# Altium project GPS_tracker.PrjPcb
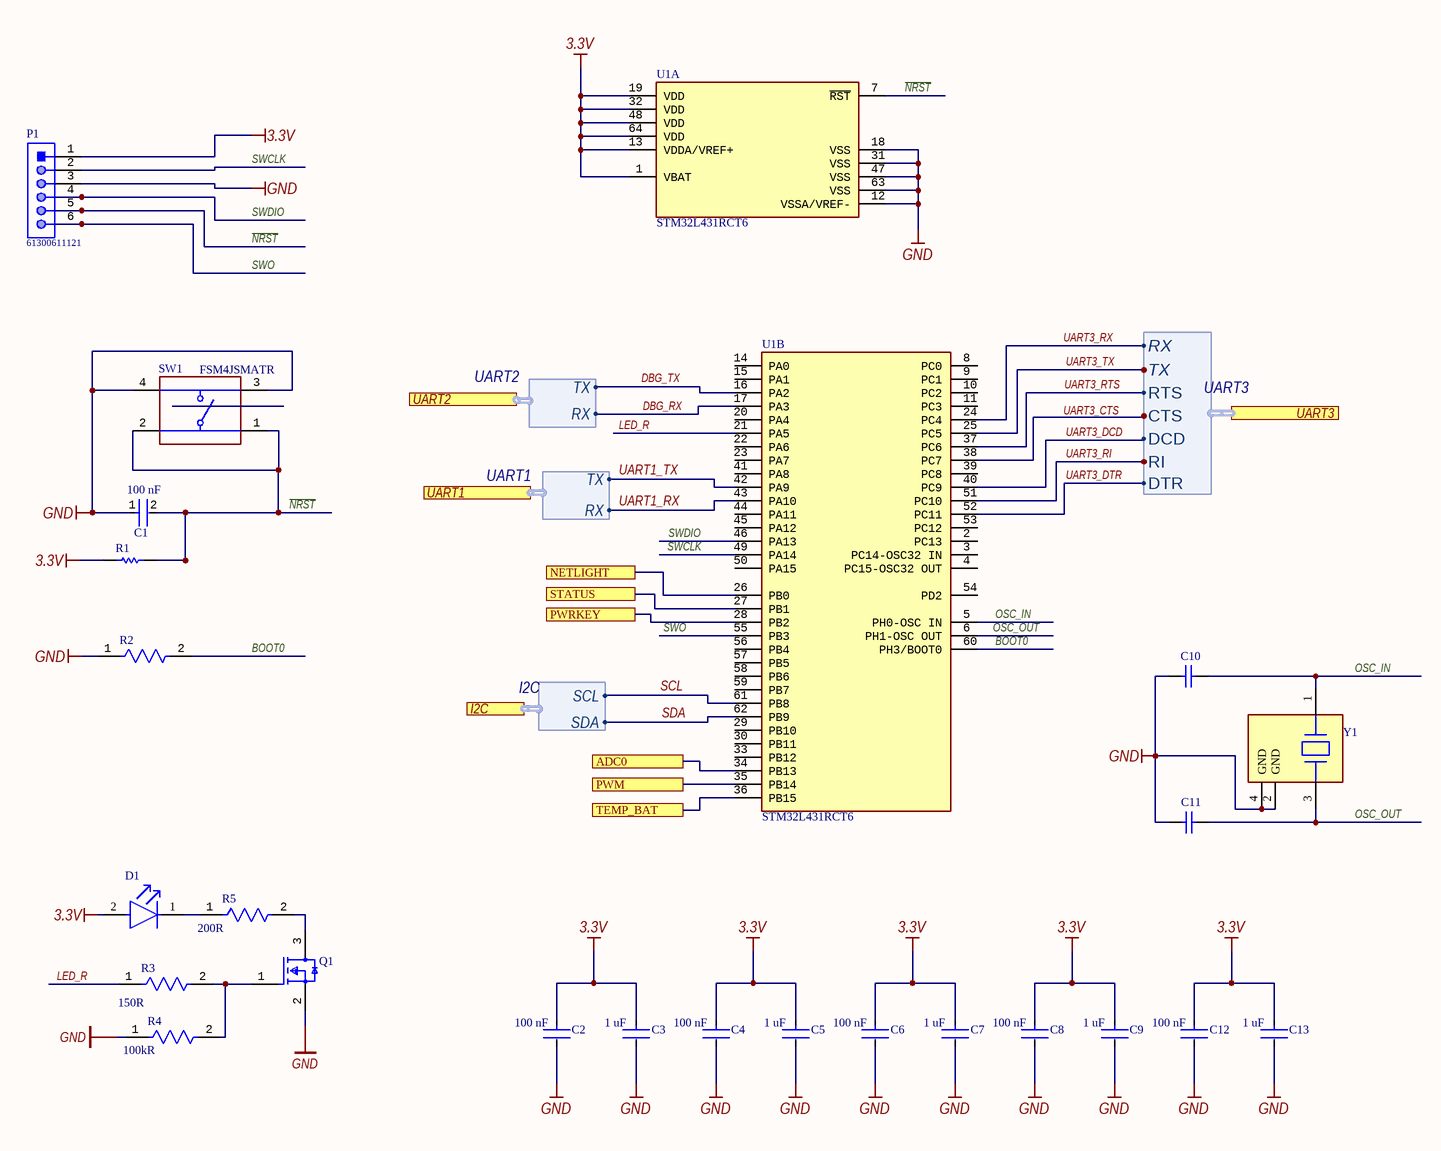
[diagram p0: GPS_tracker MCU.SchDoc]
Title2str: Project; Title: Device; ProjectNumber: 000654321; Organization: Encata
3 sheets, 71 parts. Net scope: flat (ports and power ports of the same name join across sheets).
Board file: GPS_tracker PCB.PcbDoc
Sheets:
  GPS_tracker MCU.SchDoc
  GPS_tracker PWR.SchDoc
  GPS_tracker_GPS_and_GSM.SchDoc

## Sheet GPS_tracker MCU.SchDoc: Device
size 420 x 297 mm; SheetNumber: 1; SheetTotal: 3; ProjectTitle: Prj name

### Parts
C1  Capacitance: 100 nF  [FP-CC0603-DA-MFG]  (hidden comment: CC0603KRX7R7BB104)
C2  Capacitance: 100 nF  [FP-CC0603-DA-MFG]  (hidden comment: CC0603KRX7R7BB104)
C3  Capacitance: 1 uF  [FP-CC0603-DA-MFG]  (hidden comment: CC0603KRX7R7BB105)
C4  Capacitance: 100 nF  [FP-CC0603-DA-MFG]  (hidden comment: CC0603KRX7R7BB104)
C5  Capacitance: 1 uF  [FP-CC0603-DA-MFG]  (hidden comment: CC0603KRX7R7BB105)
C6  Capacitance: 100 nF  [FP-CC0603-DA-MFG]  (hidden comment: CC0603KRX7R7BB104)
C7  Capacitance: 1 uF  [FP-CC0603-DA-MFG]  (hidden comment: CC0603KRX7R7BB105)
C8  Capacitance: 100 nF  [FP-CC0603-DA-MFG]  (hidden comment: CC0603KRX7R7BB104)
C9  Capacitance: 1 uF  [FP-CC0603-DA-MFG]  (hidden comment: CC0603KRX7R7BB105)
C10  CC0603JRNPO9BN180  [CAPC1608X90X40LL10T20]  (value not drawn)
C11  CC0603JRNPO9BN180  [CAPC1608X90X40LL10T20]  (value not drawn)
C12  Capacitance: 100 nF  [FP-CC0603-DA-MFG]  (hidden comment: CC0603KRX7R7BB104)
C13  Capacitance: 1 uF  [FP-CC0603-DA-MFG]  (hidden comment: CC0603KRX7R7BB105)
D1  150060RS75000  [FP-150060RS75000-MFG]  (value not drawn)
P1  61300611121  [61300611121]
Q1  MMBF170LT1G  [FP-318-08-IPC_B]  (value not drawn)
R1  ERJ3EKF1002V  [RESC1609X55X30LL15T15]  (value not drawn)
R2  AC0603FR-071KL  [FP-AC0603-IPC_B]  (value not drawn)
R3  Resistance: 150R  [FP-AC0603-MFG]  (hidden comment: AC0603FR-07150RL)
R4  Resistance: 100kR  [FP-RC0603-0_55-MFG]  (hidden comment: RC0603FR-07100KL)
R5  Resistance: 200R  [FP-ERJ3EK-IPC_C]  (hidden comment: ERJ-3EKF2000V)
SW1  FSM4JSMATR  [TECO-FSM4JSMATR_V]
U1  STM32L431RCT6  [FP-LQFP64-5W-MFG]  (parts A,B of 2)
Y1  ABM3B-8.000MHZ-B2-T  [FP-ABM3B-MFG]  (value not drawn)

### Ports
ADC0, I2C (harness I2C), NETLIGHT, PWM, PWRKEY, STATUS, TEMP_BAT, UART1 (harness UART1), UART2 (harness UART2), UART3 (harness UART3)

### Harnesses
UART1: RX, TX
UART2: RX, TX
I2C: SCL, SDA
UART3: RX, TX, RTS, CTS, DCD, RI, DTR

### Nets
3.3V: C2.1 C3.1 C4.1 C5.1 C6.1 C7.1 C8.1 C9.1 C12.1 C13.1 D1.2(A) P1.1 R1.1 U1.1(VBAT) U1.13(VDDA/VREF+) U1.19(VDD) U1.32(VDD) U1.48(VDD) U1.64(VDD)
GND: C1.1 C2.2 C3.2 C4.2 C5.2 C6.2 C7.2 C8.2 C9.2 C10.1 C11.1 C12.2 C13.2 P1.3 Q1.2(S) R2.1 R4.1 SW1.3 SW1.4 U1.12(VSSA/VREF-) U1.18(VSS) U1.31(VSS) U1.47(VSS) U1.63(VSS) Y1.2(GND) Y1.4(GND)
BOOT0: R2.2 U1.60(PH3/BOOT0)
LED_R: R3.1 U1.21(PA5)
~{NRST}: C1.2 P1.5 R1.2 SW1.1 SW1.2 U1.7(~{RST})
OSC_IN: C10.2 U1.5(PH0-OSC_IN) Y1.1
OSC_OUT: C11.2 U1.6(PH1-OSC_OUT) Y1.3
SCL: U1.61(PB8) ; port I2C.SCL
SDA: U1.62(PB9) ; port I2C.SDA
SWCLK: P1.2 U1.49(PA14)
SWDIO: P1.4 U1.46(PA13)
SWO: P1.6 U1.55(PB3)
UART1_RX: U1.43(PA10) ; port UART1.RX
UART1_TX: U1.42(PA9) ; port UART1.TX
UART3_DCD: U1.40(PC9) ; port UART3.DCD
UART3_DTR: U1.52(PC11) ; port UART3.DTR
UART3_RI: U1.51(PC10) ; port UART3.RI
UART3_RTS: U1.37(PC6) ; port UART3.RTS
UART3_TX: U1.25(PC5) ; port UART3.TX
NetD1_1: D1.1(C) R5.1
NetQ1_1: Q1.1(G) R3.2 R4.2
NetQ1_3: Q1.3(D) R5.2
NetU1_16: U1.16(PA2) ; port UART2.TX
NetU1_17: U1.17(PA3) ; port UART2.RX
NetU1_24: U1.24(PC4) ; port UART3.RX
NetU1_26: U1.26(PB0) ; port NETLIGHT
NetU1_27: U1.27(PB1) ; port STATUS
NetU1_28: U1.28(PB2) ; port PWRKEY
NetU1_34: U1.34(PB13) ; port ADC0
NetU1_35: U1.35(PB14) ; port PWM
NetU1_36: U1.36(PB15) ; port TEMP_BAT
NetU1_38: U1.38(PC7) ; port UART3.CTS

Not connected (* = marked no-connect by the designer): U1 2(PC13) 3(PC14-OSC32_IN) 4(PC15-OSC32_OUT) 8(PC0) 9(PC1) 10(PC2) 11(PC3) 14(PA0) 15(PA1) 20(PA4) 22(PA6) 23(PA7) 29(PB10) 30(PB11) 33(PB12) 39(PC8) 41(PA8) 44(PA11) 45(PA12) 50(PA15) 53(PC12) 54(PD2) 56(PB4) 57(PB5) 58(PB6) 59(PB7)

### Notes on the sheet
- Labels drawn without touching a wire or pin: DBG_RX, DBG_TX, UART3_CTS, UART3_RX
- Title:
- Author:
- Approved:
- Size:
- Date:
- Git Hash:
- A3
- Prj:
- Sheet
- of
- SW Version:
- Variant:
- Edited:
- CONFIDENTIAL
- File:

### Library data of the parts
C1 C2 C4 C6 C8 C12 = CMP-2000-05002-2: CAP CER 0.1UF 16V X7R 0603; Manufacturer: YAGEO; Tolerance: 0.1; Value: 100 nF; Temperature Coefficient: 15%; Material: Ceramic; Voltage Rating: 16 V; Package: CC0603-DA; ComponentLink2Description: Datasheet; Octopart: https://octopart.com/cc0603krx7r7bb104-yageo-192941; Temperature Range High: +125°C; Digikey Description: CAP CER 0.1UF 16V X7R 0603; Voltage: 16 V; Device Class L2: Capacitors; Height: 0.9mm; Temperature: -55°C to +125°C; Manufacturer Part Number: CC0603KRX7R7BB104; Device Class L1: Passive Components; Device Class L3: Ceramic Capacitors; ComponentLink2URL: http://www.yageo.com/documents/recent/UPY-GPHC_X7R_6.3V-to-50V_18.pdf; Footprint Url: http://www.yageo.com/exep/pages/download/literatures/UPY-C_GEN_24.pdf; RoHS: TRUE; Temperature Range Low: -55°C; Temperature Characteristic: X7R; Lead Free: Yes; Category: Cap; Mouser Description: Multilayer Ceramic Capacitor, CC Series, 0.1 - F, - 10%, X7R, 16 V, 0603 [1608 Metric]; Automotive: No
C3 C5 C7 C9 C13 = CMP-03422-000924-1: CAP CER 1UF 16V X7R 0603; Manufacturer: YAGEO; Tolerance: 0.1; Temperature Coefficient: 15%; Material: Ceramic; Package: CC0603-DA; RoHS: TRUE; Device Class L2: Capacitors; Temperature Characteristic: X7R; Temperature: -55°C to +125°C; Temperature Range Low: -55°C; Automotive: No; ComponentLink2Description: Datasheet; Value: 1 uF; Lead Free: Yes; ComponentLink2URL: http://www.yageo.com/documents/recent/UPY-GPHC_X7R_6.3V-to-50V_18.pdf; Device Class L1: Passive Components; Voltage: 16 V; Octopart: https://octopart.com/cc0603krx7r7bb105-yageo-42271928; Category: Cap; Digikey Description: CAP CER 1UF 16V X7R 0603; Footprint Url: http://www.yageo.com/exep/pages/download/literatures/UPY-C_GEN_24.pdf; Height: 0.9mm; Manufacturer Part Number: CC0603KRX7R7BB105; Voltage Rating: 16 V; Temperature Range High: +125°C; Mouser Description: Multilayer Ceramic Capacitor, CC Series, 1 - F, - 10%, X7R, 16 V, 0603 [1608 Metric]; Device Class L3: Ceramic Capacitors
C10 C11 = CMP-1659-00030-1: Chip Capacitor, 18 pF, +/- 5%, 50 V, -55 to 125 degC, 0603 (1608 Metric), RoHS, Tape and Reel; Voltage Rating: 50 V; Case\Package: 0603; Power Rating: 100 mW; Resistance: 68.1 Ohm; Tolerance: 1%; Case Code (Metric): 1608; Max Operating Temperature: 155 degC; RoHSCompliant: true; Case Code (Imperial): 0603; ComponentLink2Description: Datasheet; Package Quantity: 200; PackageReference: 0603; ComponentLink2URL: http://www.yageo.com/NewPortal/yageodocoutput?fileName=/pdf/MLCC/UPY-GP_NP0_16V-to-50V_14.pdf; Length: 1.6 mm; DatasheetVersion: Rev. 14, 07/2016; Min Operating Temperature: -55 degC; ComponentLink1URL: http://www.yageo.com/; Width: 0.8 mm; ComponentLink1Description: Manufacturer URL; Height: 0.45 mm; Radiation Hardening: No; PackageDescription: 2-Pin Surface Mount Device, Body 1.6 x 0.8 mm; Packaging: Tape and Reel
D1 = CMP-1426-00001-2: LED RED CLEAR 0603 SMD; Luminous Intensity: 250mcd; Viewing Angle: 140°; Dominant Wavelength: 625nm; Test Current: 20mA; Forward Current: 30mA; Forward Voltage: 2V; Lens Color: Colorless; Lens Size: 0.7mm; Width: 0.8mm; Series: WL-SMCW; Color: Red; Min Operating Temperature: -40°C; RoHS Compliant: Yes; Height: 0.8mm; Package Quantity: 1; Packaging: Cut Tape; Mount: Surface Mount; Case/Package: 0603; Lens Transparency: Clear; Length: 1.6mm; Case Code (Imperial): 0603; Lens Style: Clear; Wavelength: 625nm; Max Operating Temperature: 85°C; Case Code (Metric): 1608
P1 = CMP-1502-01070-1: THT Vertical Pin Header WR-PHD, Pitch 2.54 mm, Single Row, 6 pins; Manufacturer: Wurth Elektronik; Gender: Male; Pin Number: 6; Pitch: 2.54mm; Working Voltage: 250VAC; Rated Current: 3A; Withstanding Voltage: 500VAC; Contact Resistance: 20mOhm; Operating Temperature: -40to105degC; Packaging: Bag; Datasheet URL: https://katalog.we-online.de/em/datasheet/6130xx11121.pdf; Package Reference: 61300611121; Mounting Technology: THT; Publisher: WurthElektronik; Part Number: 61300611121; Manufacturer URL: http://www.we-online.de; Row Number: Single; Orientation: Vertical
Q1 = CMP-1058-00793-2: MOSFET N-CH 60V 500MA SOT-23; Polarization: N; Rds On Max: 5R; Power Dissipation: 225mW; Number of Elements: 1; Element Configuration: Single; Input Capacitance: 60pF; Threshold Voltage: 3V; Polarity: N-CHANNEL; Gate to Source Voltage (Vgs): 20V; Turn-Off Delay Time: 10ns; Drain to Source Breakdown Voltage: 60V; On-State Resistance: 5R; Width: 1.3mm; Voltage Rating (DC): 60V; Package Quantity: 3000; Max Operating Temperature: 150°C; Drain to Source Resistance: 5R; Drain-source On Resistance-Max: 5R; Packaging: Tape and Reel; REACH SVHC: No SVHC; Case/Package: SOT-23-3; Number of Pins: 3; RoHS Compliant: Yes; Radiation Hardening: No; Min Operating Temperature: -55°C; Continuous Drain Current (ID): 500mA; Lead Free: Lead Free; Height: 0.94mm; Current Rating: 500mA; Turn-On Delay Time: 10ns; Series: -; Max Power Dissipation: 225mW; Length: 2.9mm; Nominal Vgs: 3V
R1 = CMP-1012-00623-3: Chip Resistor, 10 KOhm, +/- 1%, 0.1 W, -55 to 155 degC, 0603 (1608 Metric), RoHS, Tape and Reel; Manufacturer: Panasonic; Voltage Rating: 75V; Case\/Package: 0603; Power Rating: 100mW; Resistance: 10KOhm; Temperature Coefficient: 100ppm\/degreesC; Number of Pins: 2; Package Reference: 603; Depth: 0.8mm; Mount: SurfaceMount; Package Description: 2-Pin Surface Mount Device, Body 1.6 x 0.85 mm; Datasheet Version: 02/2017; Length: 1.6mm; Lead Free: LeadFree; Height: 0.45mm; Number of Terminations: 2; Max Power Dissipation: 100mW; Min Operating Temperature: -55degC; Datasheet URL: https://industrial.panasonic.com/cdbs/www-data/pdf/RDA0000/AOA0000C304.pdf; Termination: SMD/SMT; Case Code (Metric): 1608; Case Code (Imperial): 0603; Tolerance: 1%; Max Operating Temperature: 155degC; RoHSCompliant: true; Voltage Rating (DC): 75V; Radiation Hardening: No; Packaging: TapeandReel; Composition: ThickFilm; Mounting Technology: SurfaceMount; Manufacturer URL: http://www.panasonic.com/; Width: 0.031inch; REACH SVHC: NoSVHC; Contact Plating: Tin; Military Standard: Not; Package Quantity: 1
R2 = CMP-2000-04828-3: RES 1kΩ 1.00% 0.1W 0603; Voltage Rating: 50V; Power Rating: 100mW; Tolerance: 1%; Temperature Coefficient: 100ppm/°C; Resistance: 1kR; Depth: 0.8mm; Case/Package: 0603; Size Code: 0603; Case Code (Metric): 1608; Height: 0.022inch; Series: AC; Width: 0.031inch; Construction: Rectangular; Length: 0.063inch; Case Code (Imperial): 0603; Package Quantity: 1; RoHS Compliant: Yes; Features: Moisture Resistant; Resistor Type: Thick Film; Max Power Dissipation: 100mW; Packaging: Tape and Reel; Termination: SMD/SMT; Ratings: AEC-Q200; Max Operating Temperature: 155°C; Min Operating Temperature: -55°C; Military Standard: Not; Lead Free: Lead Free; Number of Terminations: 2
R3 = CMP-2000-04821-3: RES 150Ω 1.00% 0.1W 0603; Voltage Rating: 50V; Power Rating: 100mW; Temperature Coefficient: 100ppm/°C; Tolerance: 1%; Resistor Type: Thick Film; Features: Moisture Resistant; Ratings: AEC-Q200; Width: 0.8mm; Packaging: Tape and Reel; Case/Package: 0603; Series: AC; RoHS Compliant: Yes; Max Power Dissipation: 100mW; Case Code (Imperial): 0603; Min Operating Temperature: -55°C; Height: 0.45mm; Termination: SMD/SMT; Number of Terminations: 2; Case Code (Metric): 1608; Max Operating Temperature: 155°C; Length: 1.6mm
R4 = CMP-2100-03662-2: RES SMD 100K OHM 1% 1/10W 0603; Voltage Rating (DC): 50V; Max Power Dissipation: 100mW; Temperature Coefficient: 100ppm/°C; Working Voltage: 75V; Length: 1.6mm; Lead Free: Lead Free; Number of Terminations: 2; Packaging: Tape and Reel; Voltage Rating: 50V; Termination: SMD/SMT; Width: 0.8mm; Resistor Type: Thick Film; Resistance Tolerance: 1%; Features: Moisture Resistant; Height: 0.45mm; Construction: Rectangular; Case/Package: 0603; Military Standard: Not; Case Code (Imperial): 0603; Series: RC; Technology: THICK FILM; Depth: 0.8mm; RoHS Compliant: Yes; REACH SVHC: No SVHC; Min Operating Temperature: -55°C; Case Code (Metric): 1608; Max Operating Temperature: 155°C; Power Rating: 100mW; Number of Pins: 2; Tolerance: 1%
R5 = CMP-2000-00316-2: RES SMD 200 OHM 1% 1/10W 0603; Power Rating: 100mW; Temperature Coefficient: 100ppm/°C; Voltage Rating (DC): 50V; Voltage Rating: 75V; Tolerance: 1%; Lead Free: Lead Free; Packaging: Tape and Reel; Case/Package: 0603; Contact Plating: Tin; Case Code (Imperial): 0603; Min Operating Temperature: -55°C; Max Operating Temperature: 155°C; Max Power Dissipation: 100mW; Features: Automotive AEC-Q200; Technology: THICK FILM; Package Quantity: 1; Resistor Type: Thick Film; REACH SVHC: No SVHC; Termination: SMD/SMT; Length: 1.6mm; Resistance Tolerance: 1%; Series: ERJ; Military Standard: Not; Radiation Hardening: No; Working Voltage: 75V; Case Code (Metric): 1608; RoHS Compliant: Yes; Mount: Surface Mount; Construction: Rectangular; Width: 0.031inch; Number of Terminations: 2; Depth: 0.8mm; Height: 0.022inch
SW1 = CMP-2000-07486-1: Micro Miniature Push Button Switch FSM JSM, 50 mA, -35 to 85 degC, 4-Pin SMD, RoHS, Tape and Reel; Manufacturer: TE Connectivity; Mechanical Life: 100000Cycles; Current Rating: 50mA; Actuator Material: Polyamide; Max Voltage Rating (DC): 12V; Capacitance: 0f; Illumination Type: Illuminated; Voltage Rating (DC): 24V; Case\/Package: SMD/SMT; Operating Force: 160gf; Contact Resistance: 100mOhm; Actuator Length: 0.055inch; Switch Travel: 0.25mm; Throw Configuration: SPST; Termination: GullWing; Contact Plating: Silver; Orientation: Straight; Mounting Technology: SurfaceMount; REACH SVHC: Unknown; Electrical Life: 100000Cycles; Package Reference: FSM4JSMATR; Max Operating Temperature: 85degC; Manufacturer URL: http://www.te.com/; Package Description: 4-Pin Surface Mount Device, Body 6 x 6 mm, Pitch 4.5 mm; Datasheet Version: Rev. V, 02/2015; Packaging: TapeandReel; Min Operating Temperature: -35degC; Mount: SurfaceMount; Contact Current Rating: 50mA; Contact Material: CopperAlloy; Package Quantity: 1200; Datasheet URL: http://www.te.com/commerce/DocumentDelivery/DDEController?Action=showdoc&DocId=Customer+Drawing%7F2-1437565-7%7FV%7Fpdf%7FEnglish%7FENG_CD_2-1437565-7_V.pdf%7F4-1437565-2; RoHSCompliant: true
U1 = CMP-12105-000010-1: IC MCU 32BIT 256KB FLASH 64LQFP; Manufacturer: STMicroelectronics; Number Of I/Os: 52; Core Architecture: ARM Cortex-M4; Number Of Pwm Channels: 11; Frequency: 80MHz; Number Of A/D Converters: 1; Number Of Timers/Counters: 8; Standoff Height: 0.05mm; Min Supply Voltage: 1.62V; Memory Size: 256KBytes; Max Supply Voltage: 3.6V; Max Junction Temp: +105°C; Interface: I2C,SPI,USART,CAN,LIN,IrDA,Other; Number Of Spi Channels: 3; Number Of Uart Channels: 4; Data Bus Width: 32bits; Number Of Adc Channels: 16; Ram Size: 64KBytes; Manufacturer Part Number: STM32L431RCT6; Digikey Description: IC MCU 32BIT 256KB FLASH 64LQFP; Device Class L3: Microcontrollers; Device Class L1: Integrated Circuits (ICs); Octopart: https://octopart.com/stm32l431rct6-stmicroelectronics-74606534; Number Of Cores: 1; Automotive: No; Device Class L2: Embedded Processors and Controllers; ComponentLink2URL: https://www.st.com/resource/en/datasheet/stm32l431rc.pdf; Height: 1.6mm; Ambient Temperature Range High: +85°C; Temperature Range High: +105°C; Ambient Temperature Range Low: -40°C; Category: IC; Memory Type: FLASH; Package: LQFP64-5W; Temperature Range Low: -40°C; Lead Free: Yes; Mouser Description: MCU 32-Bit STM32 ARM Cortex M4 RISC 256KB Flash 1.8V/2.5V/3.3V 64-Pin LQFP Tray; Temperature: -40°C to +105°C; ComponentLink2Description: Datasheet; Number Of I2C Channels: 3; RoHS: TRUE
Y1 = CMP-1688-00002-2: Crystal 8MHz ±20ppm 18pF SMD-4 5mm x 3.2mm; ESR (Equivalent Series Resistance): 200R; Frequency Stability: 50ppm; Operating Frequency: 8 MHz; Mount: Surface Mount; Number of Pins: 4; Packaging: Tape and Reel; Width: 0.126inch; Case/Package: CSMD; Lead Free: Lead Free; Depth: 3.2mm; Load Capacitance: 18pF; Min Operating Temperature: -20°C; Series: ABM3B; Package Quantity: 1000; Resistor Type: Ceramic; Height: 0.043inch; Max Operating Temperature: 70°C; Frequency Tolerance: 20ppm; Series Resistance: 200R; Tolerance: 20ppm; Termination: SMD/SMT; Length: 5mm; Frequency: 8MHz

## Sheet GPS_tracker PWR.SchDoc: Device
size 420 x 297 mm; SheetNumber: 2; SheetTotal: 3; ProjectTitle: Prj name
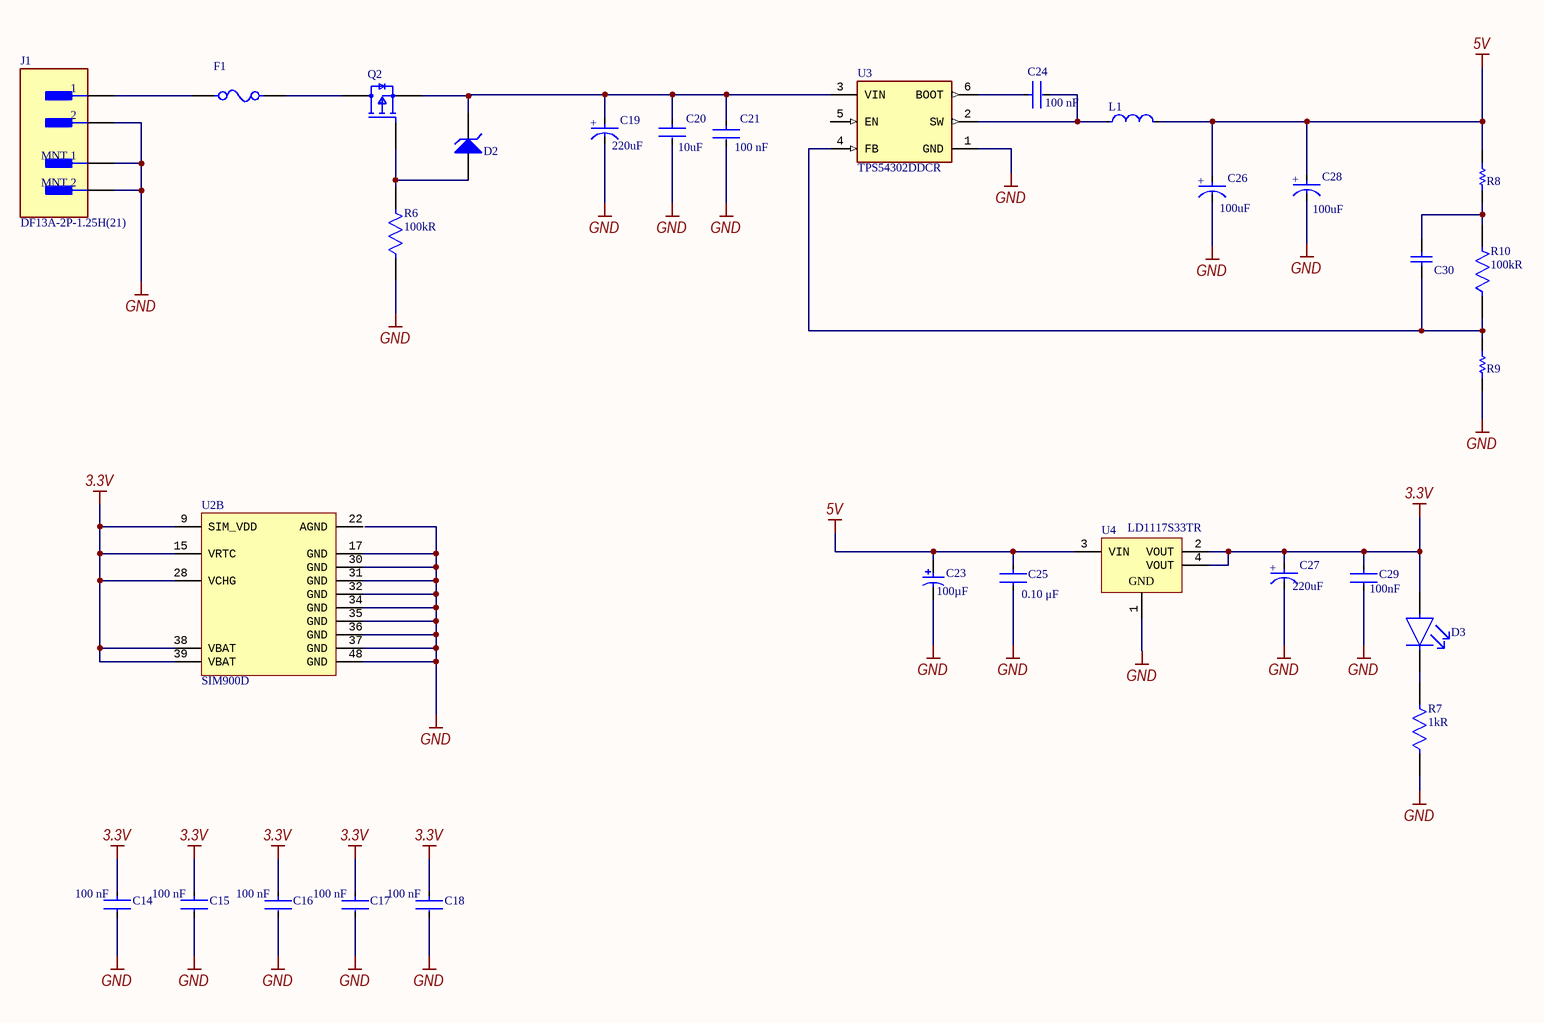
[diagram p1: GPS_tracker PWR.SchDoc]

### Parts
C14  Capacitance: 100 nF  [FP-CC0603-DA-MFG]  (hidden comment: CC0603KRX7R7BB104)
C15  Capacitance: 100 nF  [FP-CC0603-DA-MFG]  (hidden comment: CC0603KRX7R7BB104)
C16  Capacitance: 100 nF  [FP-CC0603-DA-MFG]  (hidden comment: CC0603KRX7R7BB104)
C17  Capacitance: 100 nF  [FP-CC0603-DA-MFG]  (hidden comment: CC0603KRX7R7BB104)
C18  Capacitance: 100 nF  [FP-CC0603-DA-MFG]  (hidden comment: CC0603KRX7R7BB104)
C19  Capacitance: 220uF  [FP-FKF-MFG]  (hidden comment: EEEFK1V221P)
C20  Capacitance: 10uF  [FP-CL32-IPC_C]  (hidden comment: CL32B106KBJNNNE)
C21  Capacitance: 100 nF  [FP-CC0603-DA-MFG]  (hidden comment: CC0603KRX7R7BB104)
C23  Capacitance: 100µF  [PNSC-EEEFK1C101P_L]  (hidden comment: EEEFK1C101P)
C24  Capacitance: 100 nF  [FP-CC0603-DA-MFG]  (hidden comment: CC0603KRX7R7BB104)
C25  value 0.10 μF  [FP-C0805C-DN-MFG]  (hidden comment: C0805C104K5RACTU)
C26  Capacitance: 100uF  [FP-T521D107M025ATE040-MFG]  (hidden comment: T521D107M025ATE040)
C27  Capacitance: 220uF  [FP-TAJC-MFG]  (hidden comment: TAJC227K006RNJ)
C28  Capacitance: 100uF  [FP-T521D107M025ATE040-MFG]  (hidden comment: T521D107M025ATE040)
C29  Capacitance: 100nF  [FP-C0603-CJ-MFG]  (hidden comment: C0603X104K5RACTU)
C30  06035A750JAT2A  [CAPC1608X90X35ML15T15]  (value not drawn)
D2  MMSZ4699T1G  [ONSC-SOD-123-2-425-04_V]  (value not drawn)
D3  SML-D12P8WT86C  [FP-SML-D12-MFG]  (value not drawn)
F1  0452001.MRL  [FP-0452-MFG]  (value not drawn)
J1  DF13A-2P-1.25H(21)  [FP-DF13A-2P-1_25H_21-MFG]
L1  IHLP2525CZER100M11  [FP-IHLP-2525CZ-FP_2_413x3-MFG]  (value not drawn)
Q2  DMP3099L-7  [FP-SOT23-IPC_B]  (value not drawn)
R6  Resistance: 100kR  [FP-RC0603-0_55-MFG]  (hidden comment: RC0603FR-07100KL)
R7  Resistance: 1kR  [FP-CRCW0603-e3-MFG]  (hidden comment: CRCW06031K00FKEA)
R8  RC0603FR-0749R9L  [RESC1608X55X25NL10T15]  (value not drawn)
R9  ERJ-3EKF1332V  [RESC1608X55X30LL15T15]  (value not drawn)
R10  Resistance: 100kR  [FP-RC0603-0_55-MFG]  (hidden comment: RC0603FR-07100KL)
U2  SIM900D  [SIMC-SIM900D_V]  (part B of 2)
U3  TPS54302DDCR  [FP-DDC0006A-MFG]
U4  LD1117S33TR  [SOT-223_L]

### Nets
3.3V: C14.1 C15.1 C16.1 C17.1 C18.1 C27.2(A) C29.1 D3.2(A) U2.9(SIM_VDD) U2.15(VRTC) U2.28(VCHG) U2.38(VBAT) U2.39(VBAT) U4.2(VOUT) U4.4(VOUT)
5V: C23.1 C25.1 C26.2(A) C28.2(A) L1.2 R8.2 U4.3(VIN)
GND: C14.2 C15.2 C16.2 C17.2 C18.2 C19.1(C) C20.2 C21.2 C23.2 C25.2 C26.1(C) C27.1(C) C28.1(C) C29.2 J1.2 J1.3(MNT_1) J1.4(MNT_2) R6.1 R7.1 R9.1 U2.17(GND) U2.30(GND) U2.31(GND) U2.32(GND) U2.34(GND) U2.35(GND) U2.36(GND) U2.37(GND) U2.48(GND) U3.1(GND) U4.1(GND)
NetC19_2: C19.2(A) C20.1 C21.1 D2.1(K) Q2.2(S) U3.3(VIN)
NetC24_1: C24.1 U3.6(BOOT)
NetC24_2: C24.2 L1.1 U3.2(SW)
NetC30_1: C30.1 R9.2 R10.1 U3.4(FB)
NetC30_2: C30.2 R8.1 R10.2
NetD2_2: D2.2(A) Q2.1(G) R6.2
NetD3_1: D3.1(C) R7.2
NetF1_1: F1.1 J1.1
NetF1_2: F1.2 Q2.3(D)

Not connected (* = marked no-connect by the designer): U2 22(AGND); U3 5(EN)

### Notes on the sheet
- Title:
- Author:
- Approved:
- Size:
- Date:
- Git Hash:
- A3
- Prj:
- Sheet
- of
- SW Version:
- Variant:
- Edited:
- CONFIDENTIAL
- File:
- (in symbol CMP-03016-000026-1) +
- (in symbol CMP-04424-000472-1) +
- (in symbol CMP-05427-000085-1) +

### Library data of the parts
C14-C18 C21 C24 = CMP-2000-05002-2: as C1 on sheet GPS_tracker MCU; Voltage Rating: 16 V; Package: CC0603-DA; ComponentLink2Description: Datasheet; Octopart: https://octopart.com/cc0603krx7r7bb104-yageo-192941; Temperature Range High: +125°C; Digikey Description: CAP CER 0.1UF 16V X7R 0603; Voltage: 16 V; Device Class L2: Capacitors; Height: 0.9mm; Temperature: -55°C to +125°C; Manufacturer Part Number: CC0603KRX7R7BB104; Device Class L1: Passive Components; Device Class L3: Ceramic Capacitors; ComponentLink2URL: http://www.yageo.com/documents/recent/UPY-GPHC_X7R_6.3V-to-50V_18.pdf; Footprint Url: http://www.yageo.com/exep/pages/download/literatures/UPY-C_GEN_24.pdf; RoHS: TRUE; Temperature Range Low: -55°C; Temperature Characteristic: X7R; Lead Free: Yes; Category: Cap; Mouser Description: Multilayer Ceramic Capacitor, CC Series, 0.1 - F, - 10%, X7R, 16 V, 0603 [1608 Metric]; Automotive: No
C19 = CMP-05427-000085-1: CAP ALUM 220UF 20% 35V SMD; Material: Aluminium; Ripple Current (AC): 600mA; Leakage Current: 3uA; Impedance: 160mR; Life (Hours): 2000Hour; Construction: Cylindrical; Voltage Rating: 35V; Voltage: 35V; Size: 10.2mm; Width: 10mm; Height: 10.2mm; Package Quantity: 1; Tolerance: 20%; Dielectric Material: Aluminium; Contact Plating: Tin; Case/Package: Radial; Lead Free: Lead Free; RoHS Compliant: Yes; Height - Seated (Max): 0.402inch; Length: 10.2mm; Radiation Hardening: No; Packaging: Tape and Reel; Mount: Surface Mount; Max Operating Temperature: 105°C; Number of Pins: 2; REACH SVHC: No SVHC; Ripple Current: 600mA; Diameter: 8mm; Termination: SMD/SMT; ESR (Equivalent Series Resistance): 160mR; Voltage Rating (DC): 35V; Min Operating Temperature: -55°C; Series: FK
C20 = CMP-2000-06110-2: Cap Ceramic 10uF 50V X7R ±10% SMD 1210 +125°C Embossed T/R; Material: Ceramic; Min Operating Temperature: -55°C; Depth: 2.5mm; Radiation Hardening: No; Packaging: Tape and Reel; Dielectric: X7R; Case Code (Metric): 3225; Height: 2.5mm; Thickness: 0.106inch; Voltage Rating (DC): 50V; Voltage Rating: 50V; Width: 0.098inch; Case Code (Imperial): 1210; Length: 3.2mm; Tolerance: 10%; Lead Free: Lead Free; Package Quantity: 1; Voltage: 50V; Mount: Surface Mount; Case/Package: 1210; Max Operating Temperature: 125°C
C23 = CMP-2000-06203-1: Aluminum Electrolytic Capacitor, 100 uF, 20%, 16 V, -55 to 105 degC, 2-Pin SMD, RoHS, Tape and Reel; Manufacturer: Panasonic; Lifetime@Temperature: 2000Hrs@105°C; Impedance: 0.36O; Ripple Current: 240mA; Rated Voltage: 16V; Type: Can; Datasheet URL: http://datasheet.octopart.com/EEEFK1C101P-Panasonic-datasheet-13266987.pdf; Package Description: 2-Pin Surface Mount Device, Body 6.6 x 6.6 mm; Manufacturer URL: http://www.panasonic.com/; Case Size/Dimension: Ø6.3x5.8mm; Series: FK; Datasheet Version: 11/2012; Mounting Technology: SurfaceMount; Package Reference: EEEFK1C101P; Operating Temp-Max: 105°C; Operating Temp Range: -55to+105°C
C25 = CMP-2007-00279-2: CAP CER 0.1UF 50V X7R 0805; Manufacturer: KEMET; Tolerance: 0.1; Temperature Coefficient: 30ppm/°C; Material: Ceramic; Manufacturer Part Number: C0805C104K5RACTU; Device Class L2: Capacitors; Temperature Range Low: -55°C; Voltage Rating: 50 V; Digikey Description: CAP CER 0.1UF 50V X7R 0805; Category: Cap; ComponentLink2Description: Datasheet; Octopart: https://octopart.com/c0805c104k5ractu-kemet-143926; RoHS: TRUE; ComponentLink2URL: https://content.kemet.com/datasheets/KEM_C1003_C0G_SMD.pdf; Temperature Characteristic: X7R; Temperature: -55°C to +125°C; Height: 0.88mm; Temperature Range High: +125°C; Device Class L1: Passive Components; Automotive: No; Lead Free: Yes; Ipc Land Pattern Name: CAPC200125X78; Device Class L3: Ceramic Capacitors; Mouser Description: Cap Ceramic 0.1uF 50V X7R 10% SMD 2.0 x 1.2 mm 125 C Paper T/R; Capacitance: 0.10 μF; Package: C0805C-DN
C26 C28 = CMP-03016-000026-1: CAP TANT POLY 100UF 25V 2917; Tolerance: 20%; ESR (Equivalent Series Resistance): 40mR; Min Operating Temperature: -55°C; Voltage Rating: 25V; Width: 0.169inch; Case Code (Imperial): 2917; Packaging: Cut Tape; Max Operating Temperature: 105°C; Length: 0.287inch; Voltage Rating (DC): 25V; Features: General Purpose; REACH SVHC: No SVHC; Height - Seated (Max): 0.122inch; Series: KO-CAP® T521; Case/Package: 2917; Case Code (Metric): 7343; Mount: Surface Mount
C27 = CMP-04424-000472-1: 220uF 6.3V  ±10% 1.2Ω 2312  SMD Tantalum Capacitor; Dissipation Factor: 8%; Leakage Current: 13.9uA; Polarity: Polar; ESR (Equivalent Series Resistance): 1.2R; Radiation Hardening: No; RoHS Compliant: Yes; Depth: 3.2mm; Dielectric Material: Tantalum; Tolerance: 10%; Voltage: 6.3V; REACH SVHC: No SVHC; Packaging: Tape and Reel; Case/Package: 2412; Number of Pins: 2; Package Quantity: 500; Min Operating Temperature: -55°C; Termination: SMD/SMT; Construction: Flat; Features: General Purpose; Series: TAJ; Voltage Rating: 6.3V; Length: 6mm; Max Operating Temperature: 125°C; Height - Seated (Max): 0.11inch; Height: 2.6mm; Lead Free: Lead Free; Voltage Rating (DC): 6.3V; Width: 3.2mm; Case Code (Metric): 6032; Case Code (Imperial): 2312; Mount: Surface Mount
C29 = CMP-2006-03300-2: CAP CER 0.1UF 50V X7R 0603; Manufacturer: Kemet; Material: Ceramic; Tolerance: 10%; Value: 100nF; Temperature Coefficient: 15%; Temperature Range High: +125°C; Temperature Range Low: -55°C; Manufacturer Part Number: C0603X104K5RACTU; Voltage: 50V; ComponentLink2Description: Datasheet; RoHS: TRUE; ComponentLink2URL: https://content.kemet.com/datasheets/KEM_C1013_X7R_FT-CAP_SMD.pdf; Device Class L3: Ceramic Capacitors; Device Class L2: Capacitors; Package: C0603-CJ; Height: 0.95mm; Device Class L1: Passive Components; Temperature Characteristic: X7R; Lead Free: Yes; Digikey Description: CAP CER 0.1UF 50V X7R 0603; Automotive: No; Mouser Description: Capacitor; Ceramic; Cap 0.1uF; Tol+10%; SMT; Flexible Termination; Vol-Rtg 50V; TR; Temperature: -55°C to +125°C; Octopart: https://octopart.com/c0603x104k5ractu-kemet-9145062; Category: Cap; Voltage Rating: 50V; Ipc Land Pattern Name: CAPC16080X80
C30 = CMP-2006-04358-1: Manufacturer: AVX Interconnect / Elco; Part Number: 06035A750JAT2A
D2 = CMP-1060-00478-1: Zener Voltage Regulator, 500 mW, 2-Pin SOD-123, Pb-Free, Tape and Reel; Manufacturer: On Semiconductor; VZ Typ (V): 12; P Max (W): 0.5; ComponentLink2URL: http://www.onsemi.com/pub_link/Collateral/MMSZ4678T1-D.PDF; PartNumber: MMSZ4699T1G; RoHS: Pb-Free; Mounting Technology: Surface Mount; Packing: Tape and Reel; ComponentLink1URL: http://www.onsemi.com/; ComponentLink2Description: Datasheet; ComponentLink3Description: Package Specification; ComponentLink1Description: Manufacturer URL; DatasheetVersion: Rev. 9; ComponentLink3URL: http://www.onsemi.com/pub_link/Collateral/425-04.PDF; PackageVersion: Rev. G, 10/2009; PackageDescription: 2-Pin SOD, Body 1.6 x 2.69 mm; PackageReference: SOD-123-2-425-04
D3 = CMP-08952-000001-1: LED GREEN 1608 SMD; Manufacturer: Rohm; Forward Current: 20mA; Luminous Intensity: 6.3mcd; Wavelength: 560nm; Automotive Grade: Grade 3; Reverse Voltage: 5V; Forward Voltage: 2.2V; Power Dissipation: 54mW; Led Orientation: Top View; Temperature Range Low: -40°C; Automotive: Yes; Height: 0.65mm; Manufacturer Part Number: SML-D12P8WT86C; Device Class L3: unset; Octopart: https://octopart.com/sml-d12p8wt86c-rohm-77740213; Lead Free: Yes; Digikey Description: LED GREEN 1608 SMD; Temperature Range High: +85°C; ComponentLink2URL: https://www.rohm.com/datasheet/SML-D12P8W(C)/sml-d12x8(c)-e; ComponentLink2Description: Datasheet; RoHS: TRUE; Device Class L2: LEDs; Package: SML-D12; Category: Diode; Temperature: -40°C to +85°C; Mouser Description: LED Uni-Color Green Automotive 2-Pin Chip 0603(1608Metric) T/R; Colour: Green; Device Class L1: Optoelectronics
F1 = CMP-08605-000042-1: FUSE BRD MNT 1A 125VAC/VDC 2SMD; Manufacturer: Littelfuse Inc; Fuse I2T: 1.98A2Sec; Max Fuse Ac Voltage: 125V; Resistance: 0.225Ω; Fuse Interrupt Ac Current: 50A; Fuse Interrupt Dc Current: 300A; Value: 0.225Ω; Fuse Blow Speed: Slow; Temperature: -55°C to +125°C; Temperature Range High: +125°C; Package: 0452; ComponentLink2URL: https://www.littelfuse.com/~/media/electronics/datasheets/fuses/littelfuse_fuse_452_454_datasheet.pdf.pdf; Max Fuse Dc Voltage: 125V; Temperature Range Low: -55°C; Device Class L2: Fuses; Mouser Description: Surface Mount Fuses 125V 1A; Device Class L3: unset; ComponentLink2Description: Datasheet; Device Class L1: Circuit Protection; Fuse Current: 1A; Automotive: No; Digikey Description: FUSE BRD MNT 1A 125VAC/VDC 2SMD; Height: 2.94mm; Category: Fuse; Octopart: https://octopart.com/0452001.mrl-littelfuse-566112; Manufacturer Part Number: 0452001.MRL; Voltage Rating: 125V; Lead Free: Yes; RoHS: TRUE
J1 = CMP-11610-000001-1: CONN HEADER SMD R/A 2POS 1.25MM; Manufacturer: Hirose; Voltage Rating: 150V; Current Rating: 1A; Conn Gender: Male; Number Of Contacts: 2; Conn Orientation: Right Angle; Digikey Description: CONN HEADER SMD R/A 2POS 1.25MM; ComponentLink2Description: Datasheet; Automotive: No; Temperature: -35°C to +85°C; RoHS: TRUE; Category: Conn; Contact Material: Tin; Device Class L2: Headers and Wire Housings; Temperature Range Low: -35°C; Number Of Rows: 1; Device Class L3: unset; ComponentLink2URL: https://www.hirose.com/product/download/?distributor=digikey&type=2d&lang=en&num=DF13A-2P-1.25H(21); Pitch: 1.25mm; Package: 0; Manufacturer Part Number: DF13A-2P-1.25H(21); Lead Free: Yes; Temperature Range High: +85°C; Height: 3.75mm; Device Class L1: Connectors; Octopart: https://octopart.com/df13a-2p-1.25h%2821%29-hirose-24789905; Mouser Description: Headers & Wire Housings 2P SNG ROW PIN HDR R/A SMT
L1 = CMP-02424-000281-1: Commercial Inductors, Low DCR Series 10uH 4A 71.2mΩ 20%; Self Resonant Frequency: 5MHz; Shielding: Shielded; Saturation Current: 3.5A; Max DC Current: 3A; Test Frequency: 100kHz; Core Material: Ferrite; DC Resistance (DCR): 71.2mR; Mount: Surface Mount; Military Standard: Not; Tolerance: 20%; Contact Plating: Tin; Package Quantity: 2000; Packaging: Tape and Reel; Current Rating: 4A; Lead Free: Lead Free; Depth: 6.72mm; Height - Seated (Max): 0.118inch; Max Operating Temperature: 125°C; Termination: SMD/SMT; Inductance: 10uH; RMS Current (Irms): 4A; Case Code (Metric): 6363; Length: 7.24mm; Number of Pins: 2; Inductance Tolerance: 20%; Height: 3mm; Width: 0.255inch; Radiation Hardening: No; Case Code (Imperial): 2525; Case/Package: 2525; Min Operating Temperature: -55°C
Q2 = CMP-12801-000062-2: MOSFET P-CH 30V SOT23; Gate to Source Voltage (Vgs): 20V; Turn-Off Delay Time: 31ns; Drain to Source Voltage (Vdss): -30V; Fall Time: 15ns; Threshold Voltage: -2.1V; Rise Time: 5ns; Input Capacitance: 563pF; Number of Channels: 1; Drain to Source Resistance: 65mR; Element Configuration: Single; Max Power Dissipation: 1.08W; Turn-On Delay Time: 4.8ns; Continuous Drain Current (ID): 3.8A; Lead Free: Lead Free; Number of Pins: 3; Package Quantity: 3000; Width: 1.4mm; Radiation Hardening: No; Mount: Surface Mount; Case/Package: SOT-23; Contact Plating: Tin; Rds On Max: 65mR; Height: 1.1mm; REACH SVHC: No SVHC; Weight: 0.000282oz; Max Operating Temperature: 150°C; Packaging: Tape and Reel; Min Operating Temperature: -55°C; Length: 3mm
R6 R10 = CMP-2100-03662-2: as R4 on sheet GPS_tracker MCU; Length: 1.6mm; Lead Free: Lead Free; Number of Terminations: 2; Packaging: Tape and Reel; Voltage Rating: 50V; Termination: SMD/SMT; Width: 0.8mm; Resistor Type: Thick Film; Resistance Tolerance: 1%; Features: Moisture Resistant; Height: 0.45mm; Construction: Rectangular; Case/Package: 0603; Military Standard: Not; Case Code (Imperial): 0603; Series: RC; Technology: THICK FILM; Depth: 0.8mm; RoHS Compliant: Yes; REACH SVHC: No SVHC; Min Operating Temperature: -55°C; Case Code (Metric): 1608; Max Operating Temperature: 155°C; Power Rating: 100mW; Number of Pins: 2; Tolerance: 1%
R7 = CMP-1666-00003-5: RES Thick Film, 1kΩ, 1%, 0.1W, 100ppm/°C, 0603; Max Power Dissipation: 100mW; Voltage Rating: 75V; Max Operating Temperature: 155°C; Number of Pins: 2; Case Code (Imperial): 0603; Width: 0.033inch; Power Rating: 100mW; Number of Terminations: 2; Package Quantity: 10; Weight: 7.1E-05oz; Tolerance: 1%; Temperature Coefficient: 100ppm/°C; Military Standard: Not; Mount: Surface Mount; Voltage Rating (DC): 75V; Depth: 0.85mm; Composition: Thick Film; Radiation Hardening: No; Termination: SMD/SMT; Length: 1.55mm; Case Code (Metric): 1608; Contact Plating: Tin; Min Operating Temperature: -55°C; Packaging: Tape and Reel; Height: 0.45mm; Lead Free: Lead Free; Case/Package: 0603; Features: Automotive AEC-Q200
R8 = CMP-1659-00036-1: General Purpose Chip Resistor, 49.9 Ohm, +/- 1%, -55 to 155 degC, 0603 (1608 Metric), RoHS, Tape and Reel; Max Supply Voltage: 3.63 V; Case\Package: LQFP; Interface: SPI; Min Supply Voltage: 2.97 V; PackageReference: 0603; Packaging: Tray; ComponentLink2Description: Datasheet; ComponentLink1Description: Manufacturer URL; ComponentLink2URL: https://datasheet.ciiva.com/11808/0900766b80f96399-11808223.pdf; RoHSCompliant: true; Max Operating Temperature: 85 degC; ComponentLink1URL: http://www.yageo.com/; PackageDescription: 2-Pin Surface Mount Device, Body 1.6 x 0.8 mm; DatasheetVersion: Rev. 4, 04/2009; Min Operating Temperature: -40 degC; Package Quantity: 250; Pins: 48
R9 = CMP-2000-00238-1: Manufacturer: Panasonic; Part Number: ERJ-3EKF1332V
U2 = CMP-2000-07069-1: Quad-Band GSM/GPRS Module, 850/900/1800/1900 MHz, 3.2 to 4.8 V, -40 to 85 degC, 48-Pin SMD, RoHS, Tape and Reel; Manufacturer: SIM Com; Datasheet Version: Rev. 2.02, 05/2012; Datasheet URL: http://mt-system.ru/sites/default/files/documents/sim900d_hardware_design_v2.02_0.pdf; Mounting Technology: SurfaceMount; Package Description: 48-Pin Surface Mount Device, Body 33 x 33 mm, Pitch 1.5 mm; Package Reference: SIM900D; Manufacturer URL: http://simcomm2m.com/
U3 = CMP-04918-000032-1: IC REG BUCK ADJ 3A TSOT23-6; Manufacturer: Texas Instruments; Output Voltage: 0.6-26V; Output Type: AdjustableProgrammable; Max Junction Temp: +125°C; Number Of Outputs: 1; Min Supply Voltage: 4.5V; Switching Frequency: 400kHz; Standoff Height: 0mm; Max Duty Cycle: 100%; Nominal Supply Current: 45uA; Max Supply Voltage: 28V; Temperature Range High: +125°C; Switching Topology: Buck; Device Class L2: Power Management ICs; Output Current: 3A; Automotive: No; Temperature Range Low: -40°C; Temperature: -40°C to +125°C; Height: 1.1mm; Ipc Land Pattern Name: SOT95P280X110-6; RoHS: TRUE; Digikey Description: IC REG BUCK ADJ 3A TSOT23-6; Manufacturer Part Number: TPS54302DDCR; ComponentLink2Description: Datasheet; Device Class L3: Voltage Regulators - Switching; Octopart: https://octopart.com/tps54302ddcr-texas+instruments-74209025; Device Class L1: Integrated Circuits (ICs); Lead Free: Yes; ComponentLink2URL: http://www.ti.com/lit/ds/symlink/tps54302.pdf; Category: IC; Package: DDC0006A
U4 = CMP-0244-00310-1: Fixed Low Drop Positive Voltage Regulator, 3.3V, 4-Pin SOT-223, Tape and Reel; ComponentLink2Description: Datasheet; PackageDescription: 4-Pin SOT-223 Package, 6.5 x 3.5 mm Body, 2.3 mm Pitch, 7 mm Lead Span; PackageVersion: 2010; ComponentLink2URL: http://www.st.com/internet/com/TECHNICAL_RESOURCES/TECHNICAL_LITERATURE/DATASHEET/CD00000544.pdf; PackageReference: SOT-223; DatasheetVersion: 1/11/2011; ComponentLink1Description: Manufacturer URL; ComponentLink1URL: http://www.st.com

## Sheet GPS_tracker_GPS_and_GSM.SchDoc: Device
size 420 x 297 mm; SheetNumber: 3; SheetTotal: 3; ProjectTitle: Prj name
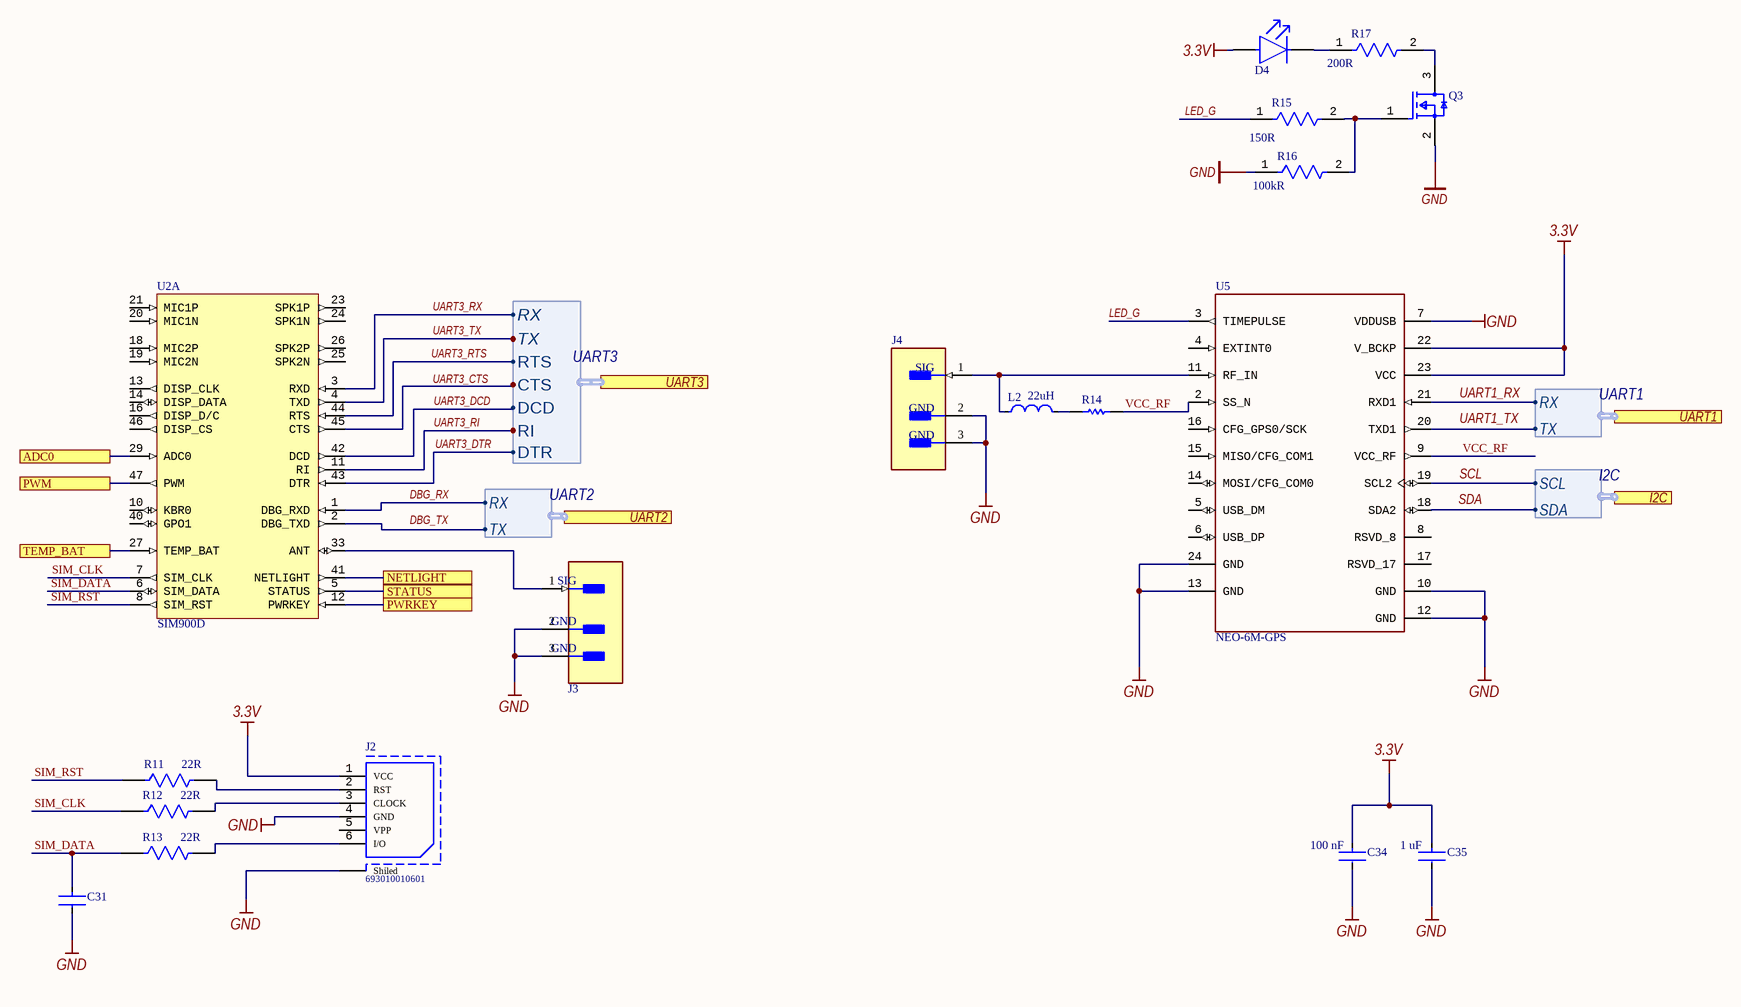
[diagram p2: GPS_tracker_GPS_and_GSM.SchDoc]

### Parts
C31  06035A220JAT2A  [FP-0603-L_1_6_0_15-W_0_81-IPC_C]  (value not drawn)
C34  Capacitance: 100 nF  [FP-CC0603-DA-MFG]  (hidden comment: CC0603KRX7R7BB104)
C35  Capacitance: 1 uF  [FP-CC0603-DA-MFG]  (hidden comment: CC0603KRX7R7BB105)
D4  SML-D12P8WT86C  [FP-SML-D12-MFG]  (value not drawn)
J2  693010010601  [693010010601]
J3  U.FL-R-SMT-1(10)  [FP-U_FL-R-SMT-1_10-MFG]  (value not drawn)
J4  U.FL-R-SMT-1(10)  [FP-U_FL-R-SMT-1_10-MFG]  (value not drawn)
L2  Inductance: 22uH  [FP-IHLP-2525CZ-FP_2_413x3-MFG]  (hidden comment: IHLP2525CZER220M11)
Q3  MMBF170LT1G  [FP-318-08-IPC_B]  (value not drawn)
R11  Resistance: 22R  [FP-CRCW0603-e3-IPC_B]  (hidden comment: CRCW060322R0FKEA)
R12  Resistance: 22R  [FP-CRCW0603-e3-IPC_B]  (hidden comment: CRCW060322R0FKEA)
R13  Resistance: 22R  [FP-CRCW0603-e3-IPC_B]  (hidden comment: CRCW060322R0FKEA)
R14  ERJ1GNF22R0C  [RESC0603X26X15ML03T05]  (value not drawn)
R15  Resistance: 150R  [FP-AC0603-MFG]  (hidden comment: AC0603FR-07150RL)
R16  Resistance: 100kR  [FP-RC0603-0_55-MFG]  (hidden comment: RC0603FR-07100KL)
R17  Resistance: 200R  [FP-ERJ3EK-IPC_C]  (hidden comment: ERJ-3EKF2000V)
U2  SIM900D  [SIMC-SIM900D_V]  (part A of 2)
U5  NEO-6M-GPS  [XCVR_NEO-6M-GPS]

### Ports
ADC0, I2C (harness I2C), NETLIGHT, PWM, PWRKEY, STATUS, TEMP_BAT, UART1 (harness UART1), UART2 (harness UART2), UART3 (harness UART3)

### Harnesses
UART1: RX, TX
UART2: RX, TX
UART3: RX, TX, RTS, CTS, DCD, RI, DTR
I2C: SCL, SDA

### Nets
3.3V: C34.1 C35.1 D4.2(A) J2.1(VCC) U5.22(V_BCKP) U5.23(VCC)
GND: C31.2 C34.2 C35.2 J2.4(GND) J2.Shiled J3.2(GND) J3.3(GND) J4.2(GND) J4.3(GND) R16.1 U5.7(VDDUSB) U5.10(GND) U5.12(GND) U5.13(GND) U5.24(GND)
LED_G: R15.1 U5.3(TIMEPULSE)
SDA: U5.18(SDA2) ; port I2C.SDA
SIM_CLK: R12.1 U2.7(SIM_CLK)
SIM_DATA: C31.1 R13.1
SIM_RST: R11.1 U2.8(SIM_RST)
UART1_RX: U5.21(RXD1) ; port UART1.RX
UART1_TX: U5.20(TXD1) ; port UART1.TX
UART3_DCD: U2.42(DCD) ; port UART3.DCD
UART3_RI: U2.11(RI) ; port UART3.RI
UART3_RTS: U2.44(RTS) ; port UART3.RTS
UART3_TX: U2.4(TXD) ; port UART3.TX
VCC_RF: R14.2 U5.2(SS_N)
NetD4_1: D4.1(C) R17.1
NetJ2_2: J2.2(RST) R11.2
NetJ2_3: J2.3(CLOCK) R12.2
NetJ2_6: J2.6(I/O) R13.2
NetJ3_1: J3.1(SIG) U2.33(ANT)
NetJ4_1: J4.1(SIG) L2.1 U5.11(RF_IN)
NetL2_2: L2.2 R14.1
NetQ3_1: Q3.1(G) R15.2 R16.2
NetQ3_3: Q3.3(D) R17.2
NetU1_16: U2.2(DBG_TXD) ; port UART2.TX
NetU1_17: U2.1(DBG_RXD) ; port UART2.RX
NetU1_24: U2.3(RXD) ; port UART3.RX
NetU1_26: U2.41(NETLIGHT) ; port NETLIGHT
NetU1_27: U2.5(STATUS) ; port STATUS
NetU1_28: U2.12(PWRKEY) ; port PWRKEY
NetU1_34: U2.29(ADC0) ; port ADC0
NetU1_35: U2.47(PWM) ; port PWM
NetU1_36: U2.27(TEMP_BAT) ; port TEMP_BAT
NetU1_38: U2.45(CTS) ; port UART3.CTS

Not connected (* = marked no-connect by the designer): J2 5(VPP); Q3 2(S); U2 6(SIM_DATA) 10(KBR0) 13(DISP_CLK) 14(DISP_DATA) 16(DISP_D/C) 18(MIC2P) 19(MIC2N) 20(MIC1N) 21(MIC1P) 23(SPK1P) 24(SPK1N) 25(SPK2N) 26(SPK2P) 40(GPO1) 43(DTR) 46(DISP_CS); U5 4(EXTINT0) 5(USB_DM) 6(USB_DP) 8(RSVD_8) 9(VCC_RF) 14(MOSI/CFG_COM0) 15(MISO/CFG_COM1) 16(CFG_GPS0/SCK) 17(RSVD_17) 19(SCL2)

### Notes on the sheet
- Labels drawn without touching a wire or pin: DBG_RX, DBG_TX, SCL, SDA, SIM_DATA, UART1_RX, UART1_TX, UART3_CTS, UART3_RX, VCC_RF
- Title:
- Author:
- Approved:
- Size:
- Date:
- Git Hash:
- A3
- Prj:
- Sheet
- of
- SW Version:
- Variant:
- Edited:
- CONFIDENTIAL
- File:

### Library data of the parts
C31 = CMP-2006-04207-3: General Purpose Ceramic Capacitor, 0603, 22pF, 5%, NP0, 30ppm/°C, 50V; Dielectric: C0G; Insulation Resistance: 100GR; Termination: SMD/SMT; Lead Free: Lead Free; Package Quantity: 1; Thickness: 0.035inch; Packaging: Tape and Reel; Radiation Hardening: No; Voltage Rating: 50V; Depth: 0.81mm; Case Code (Metric): 1608; Min Operating Temperature: -55°C; Number of Pins: 2; REACH SVHC: No SVHC; RoHS Compliant: Yes; Mount: Surface Mount; Case/Package: 0603; Width: 0.81mm; Case Code (Imperial): 0603; Max Operating Temperature: 125°C; Contact Plating: Tin; Temperature Coefficient: 30ppm/°C; Voltage Rating (DC): 50V; Height: 0.63mm; Dielectric Material: Ceramic; Capacitance: 22pF; Voltage: 50V; Length: 1.6mm; Tolerance: 5%
C34 = CMP-2000-05002-2: as C1 on sheet GPS_tracker MCU; Voltage Rating: 16 V; Package: CC0603-DA; ComponentLink2Description: Datasheet; Octopart: https://octopart.com/cc0603krx7r7bb104-yageo-192941; Temperature Range High: +125°C; Digikey Description: CAP CER 0.1UF 16V X7R 0603; Voltage: 16 V; Device Class L2: Capacitors; Height: 0.9mm; Temperature: -55°C to +125°C; Manufacturer Part Number: CC0603KRX7R7BB104; Device Class L1: Passive Components; Device Class L3: Ceramic Capacitors; ComponentLink2URL: http://www.yageo.com/documents/recent/UPY-GPHC_X7R_6.3V-to-50V_18.pdf; Footprint Url: http://www.yageo.com/exep/pages/download/literatures/UPY-C_GEN_24.pdf; RoHS: TRUE; Temperature Range Low: -55°C; Temperature Characteristic: X7R; Lead Free: Yes; Category: Cap; Mouser Description: Multilayer Ceramic Capacitor, CC Series, 0.1 - F, - 10%, X7R, 16 V, 0603 [1608 Metric]; Automotive: No
C35 = CMP-03422-000924-1: as C3 on sheet GPS_tracker MCU; Package: CC0603-DA; RoHS: TRUE; Device Class L2: Capacitors; Temperature Characteristic: X7R; Temperature: -55°C to +125°C; Temperature Range Low: -55°C; Automotive: No; ComponentLink2Description: Datasheet; Value: 1 uF; Lead Free: Yes; ComponentLink2URL: http://www.yageo.com/documents/recent/UPY-GPHC_X7R_6.3V-to-50V_18.pdf; Device Class L1: Passive Components; Voltage: 16 V; Octopart: https://octopart.com/cc0603krx7r7bb105-yageo-42271928; Category: Cap; Digikey Description: CAP CER 1UF 16V X7R 0603; Footprint Url: http://www.yageo.com/exep/pages/download/literatures/UPY-C_GEN_24.pdf; Height: 0.9mm; Manufacturer Part Number: CC0603KRX7R7BB105; Voltage Rating: 16 V; Temperature Range High: +125°C; Mouser Description: Multilayer Ceramic Capacitor, CC Series, 1 - F, - 10%, X7R, 16 V, 0603 [1608 Metric]; Device Class L3: Ceramic Capacitors
D4 = CMP-08952-000001-1: as D3 on sheet GPS_tracker PWR; Temperature Range Low: -40°C; Automotive: Yes; Height: 0.65mm; Manufacturer Part Number: SML-D12P8WT86C; Device Class L3: unset; Octopart: https://octopart.com/sml-d12p8wt86c-rohm-77740213; Lead Free: Yes; Digikey Description: LED GREEN 1608 SMD; Temperature Range High: +85°C; ComponentLink2URL: https://www.rohm.com/datasheet/SML-D12P8W(C)/sml-d12x8(c)-e; ComponentLink2Description: Datasheet; RoHS: TRUE; Device Class L2: LEDs; Package: SML-D12; Category: Diode; Temperature: -40°C to +85°C; Mouser Description: LED Uni-Color Green Automotive 2-Pin Chip 0603(1608Metric) T/R; Colour: Green; Device Class L1: Optoelectronics
J2 = CMP-1502-00154-1: WR-CRD Mini SIM Card Connector Header; Manufacturer: Wurth Elektronik; Working Voltage: 50VAC; Rated Current: 0.5A; Withstanding Voltage: 500VAC; Publisher: WurthElektronik; Part Number: 693010010601; Operating Temperature: -25to85degC; Packaging: TapeandReel; Datasheet URL: https://katalog.we-online.de/em/datasheet/693010010601.pdf; Package Reference: 693010010601; Mounting Technology: SMT; Manufacturer URL: http://www.we-online.de
J3 J4 = CMP-2000-05152-3: CONN U.FL RCPT STR 50 OHM SMD; Max Frequency: 6GHz; Connector Type: Coaxial; Body Plating: Silver; Body Material: Bronze; Impedance: 50R; Dielectric Material: Polymer; Insulation Resistance: 500MR; Gender: Male; Packaging: Cut Tape; Length: 3mm; Package Quantity: 2500; Termination: Solder; Lead Free: Lead Free; Series: U.FL; Min Operating Temperature: -40°C; Fastening Type: Snap; Contact Material: Brass; Orientation: Straight; Wire/Cable Type: Coaxial; Frequency: 6GHz; Contact Plating: Gold; Depth: 3.1mm; Weight: 0.001764oz; Max Operating Temperature: 90°C; Radiation Hardening: No; REACH SVHC: No SVHC; Mount: Surface Mount; Housing Color: Beige
L2 = CMP-2000-06442-2: Commercial Inductors, Low DCR Series 22uH 2.9A 135mΩ 20%; Self Resonant Frequency: 1MHz; Shielding: Shielded; Core Material: Ferrite; DC Resistance (DCR): 135mR; Test Frequency: 100kHz; Saturation Current: 2.5A; Case/Package: 2525; Inductance Tolerance: 20%; Max DC Current: 2.9A; Termination: SMD/SMT; Case Code (Imperial): 2525; Mount: Surface Mount; Military Standard: Not; Min Operating Temperature: -55°C; RMS Current (Irms): 2.9A; Package Quantity: 2000; Max Operating Temperature: 125°C; Length: 7.24mm; Depth: 6.72mm; Packaging: Tape and Reel; Height: 3mm; Width: 0.255inch; Lead Free: Lead Free; Tolerance: 20%; Contact Plating: Tin; Current Rating: 2.9A; Number of Pins: 2; Case Code (Metric): 6363; Radiation Hardening: No; Height - Seated (Max): 0.118inch
Q3 = CMP-1058-00793-2: as Q1 on sheet GPS_tracker MCU; Drain to Source Breakdown Voltage: 60V; On-State Resistance: 5R; Width: 1.3mm; Voltage Rating (DC): 60V; Package Quantity: 3000; Max Operating Temperature: 150°C; Drain to Source Resistance: 5R; Drain-source On Resistance-Max: 5R; Packaging: Tape and Reel; REACH SVHC: No SVHC; Case/Package: SOT-23-3; Number of Pins: 3; RoHS Compliant: Yes; Radiation Hardening: No; Min Operating Temperature: -55°C; Continuous Drain Current (ID): 500mA; Lead Free: Lead Free; Height: 0.94mm; Current Rating: 500mA; Turn-On Delay Time: 10ns; Series: -; Max Power Dissipation: 225mW; Length: 2.9mm; Nominal Vgs: 3V
R11-R13 = CMP-2000-03097-2: RES Thick Film, 22Ω, 1%, 0.1W, 100ppm/°C, 0603; Voltage Rating: 75V; Power Rating: 100mW; Lead Free: Lead Free; Height: 0.45mm; Package Quantity: 5000; Weight: 7.1E-05oz; Width: 0.85mm; Length: 1.55mm; Mount: Surface Mount; Packaging: Tape and Reel; Termination: SMD/SMT; Temperature Coefficient: 100ppm/°C; Case/Package: 0603; Case Code (Metric): 1608; Radiation Hardening: No; Max Operating Temperature: 155°C; Military Standard: Not; Min Operating Temperature: -55°C; Case Code (Imperial): 0603; Contact Plating: Tin; Voltage Rating (DC): 75V; Tolerance: 1%; Depth: 0.85mm; Composition: Thick Film
R14 = CMP-2004-03488-1: Manufacturer: Panasonic; Part Number: ERJ1GNF22R0C
R15 = CMP-2000-04821-3: as R3 on sheet GPS_tracker MCU; Resistor Type: Thick Film; Features: Moisture Resistant; Ratings: AEC-Q200; Width: 0.8mm; Packaging: Tape and Reel; Case/Package: 0603; Series: AC; RoHS Compliant: Yes; Max Power Dissipation: 100mW; Case Code (Imperial): 0603; Min Operating Temperature: -55°C; Height: 0.45mm; Termination: SMD/SMT; Number of Terminations: 2; Case Code (Metric): 1608; Max Operating Temperature: 155°C; Length: 1.6mm
R16 = CMP-2100-03662-2: as R4 on sheet GPS_tracker MCU; Length: 1.6mm; Lead Free: Lead Free; Number of Terminations: 2; Packaging: Tape and Reel; Voltage Rating: 50V; Termination: SMD/SMT; Width: 0.8mm; Resistor Type: Thick Film; Resistance Tolerance: 1%; Features: Moisture Resistant; Height: 0.45mm; Construction: Rectangular; Case/Package: 0603; Military Standard: Not; Case Code (Imperial): 0603; Series: RC; Technology: THICK FILM; Depth: 0.8mm; RoHS Compliant: Yes; REACH SVHC: No SVHC; Min Operating Temperature: -55°C; Case Code (Metric): 1608; Max Operating Temperature: 155°C; Power Rating: 100mW; Number of Pins: 2; Tolerance: 1%
R17 = CMP-2000-00316-2: as R5 on sheet GPS_tracker MCU; Tolerance: 1%; Lead Free: Lead Free; Packaging: Tape and Reel; Case/Package: 0603; Contact Plating: Tin; Case Code (Imperial): 0603; Min Operating Temperature: -55°C; Max Operating Temperature: 155°C; Max Power Dissipation: 100mW; Features: Automotive AEC-Q200; Technology: THICK FILM; Package Quantity: 1; Resistor Type: Thick Film; REACH SVHC: No SVHC; Termination: SMD/SMT; Length: 1.6mm; Resistance Tolerance: 1%; Series: ERJ; Military Standard: Not; Radiation Hardening: No; Working Voltage: 75V; Case Code (Metric): 1608; RoHS Compliant: Yes; Mount: Surface Mount; Construction: Rectangular; Width: 0.031inch; Number of Terminations: 2; Depth: 0.8mm; Height: 0.022inch
U2 = CMP-2000-07069-1: as U2 on sheet GPS_tracker PWR; Datasheet Version: Rev. 2.02, 05/2012; Datasheet URL: http://mt-system.ru/sites/default/files/documents/sim900d_hardware_design_v2.02_0.pdf; Mounting Technology: SurfaceMount; Package Description: 48-Pin Surface Mount Device, Body 33 x 33 mm, Pitch 1.5 mm; Package Reference: SIM900D; Manufacturer URL: http://simcomm2m.com/
U5 = NEO-6M-GPS: GPS Development Tools SparkFun GNSS-RTK Dead Reckoning Breakout - ZED-F9K (Qwiic); MF: u-blox; SnapEDA_Link: https://www.snapeda.com/parts/NEO-6M-GPS/u-blox/view-part/?ref=snap; MP: NEO-6M-GPS; Availability: Not in stock; Price: None; Check_prices: https://www.snapeda.com/parts/NEO-6M-GPS/u-blox/view-part/?ref=eda; Value: *; Package: None

## Nets that join several sheets
3.3V: GPS_tracker MCU (19 pins), GPS_tracker PWR (15 pins), GPS_tracker_GPS_and_GSM (6 pins)
GND: GPS_tracker MCU (26 pins), GPS_tracker PWR (31 pins), GPS_tracker_GPS_and_GSM (15 pins)
NetU1_16: GPS_tracker MCU (U1.16), GPS_tracker_GPS_and_GSM (U2.2)
NetU1_17: GPS_tracker MCU (U1.17), GPS_tracker_GPS_and_GSM (U2.1)
NetU1_24: GPS_tracker MCU (U1.24), GPS_tracker_GPS_and_GSM (U2.3)
NetU1_26: GPS_tracker MCU (U1.26), GPS_tracker_GPS_and_GSM (U2.41)
NetU1_27: GPS_tracker MCU (U1.27), GPS_tracker_GPS_and_GSM (U2.5)
NetU1_28: GPS_tracker MCU (U1.28), GPS_tracker_GPS_and_GSM (U2.12)
NetU1_34: GPS_tracker MCU (U1.34), GPS_tracker_GPS_and_GSM (U2.29)
NetU1_35: GPS_tracker MCU (U1.35), GPS_tracker_GPS_and_GSM (U2.47)
NetU1_36: GPS_tracker MCU (U1.36), GPS_tracker_GPS_and_GSM (U2.27)
NetU1_38: GPS_tracker MCU (U1.38), GPS_tracker_GPS_and_GSM (U2.45)
SDA: GPS_tracker MCU (U1.62), GPS_tracker_GPS_and_GSM (U5.18)
UART1_RX: GPS_tracker MCU (U1.43), GPS_tracker_GPS_and_GSM (U5.21)
UART1_TX: GPS_tracker MCU (U1.42), GPS_tracker_GPS_and_GSM (U5.20)
UART3_DCD: GPS_tracker MCU (U1.40), GPS_tracker_GPS_and_GSM (U2.42)
UART3_RI: GPS_tracker MCU (U1.51), GPS_tracker_GPS_and_GSM (U2.11)
UART3_RTS: GPS_tracker MCU (U1.37), GPS_tracker_GPS_and_GSM (U2.44)
UART3_TX: GPS_tracker MCU (U1.25), GPS_tracker_GPS_and_GSM (U2.4)